# Altium project Elepaja.PrjPcb
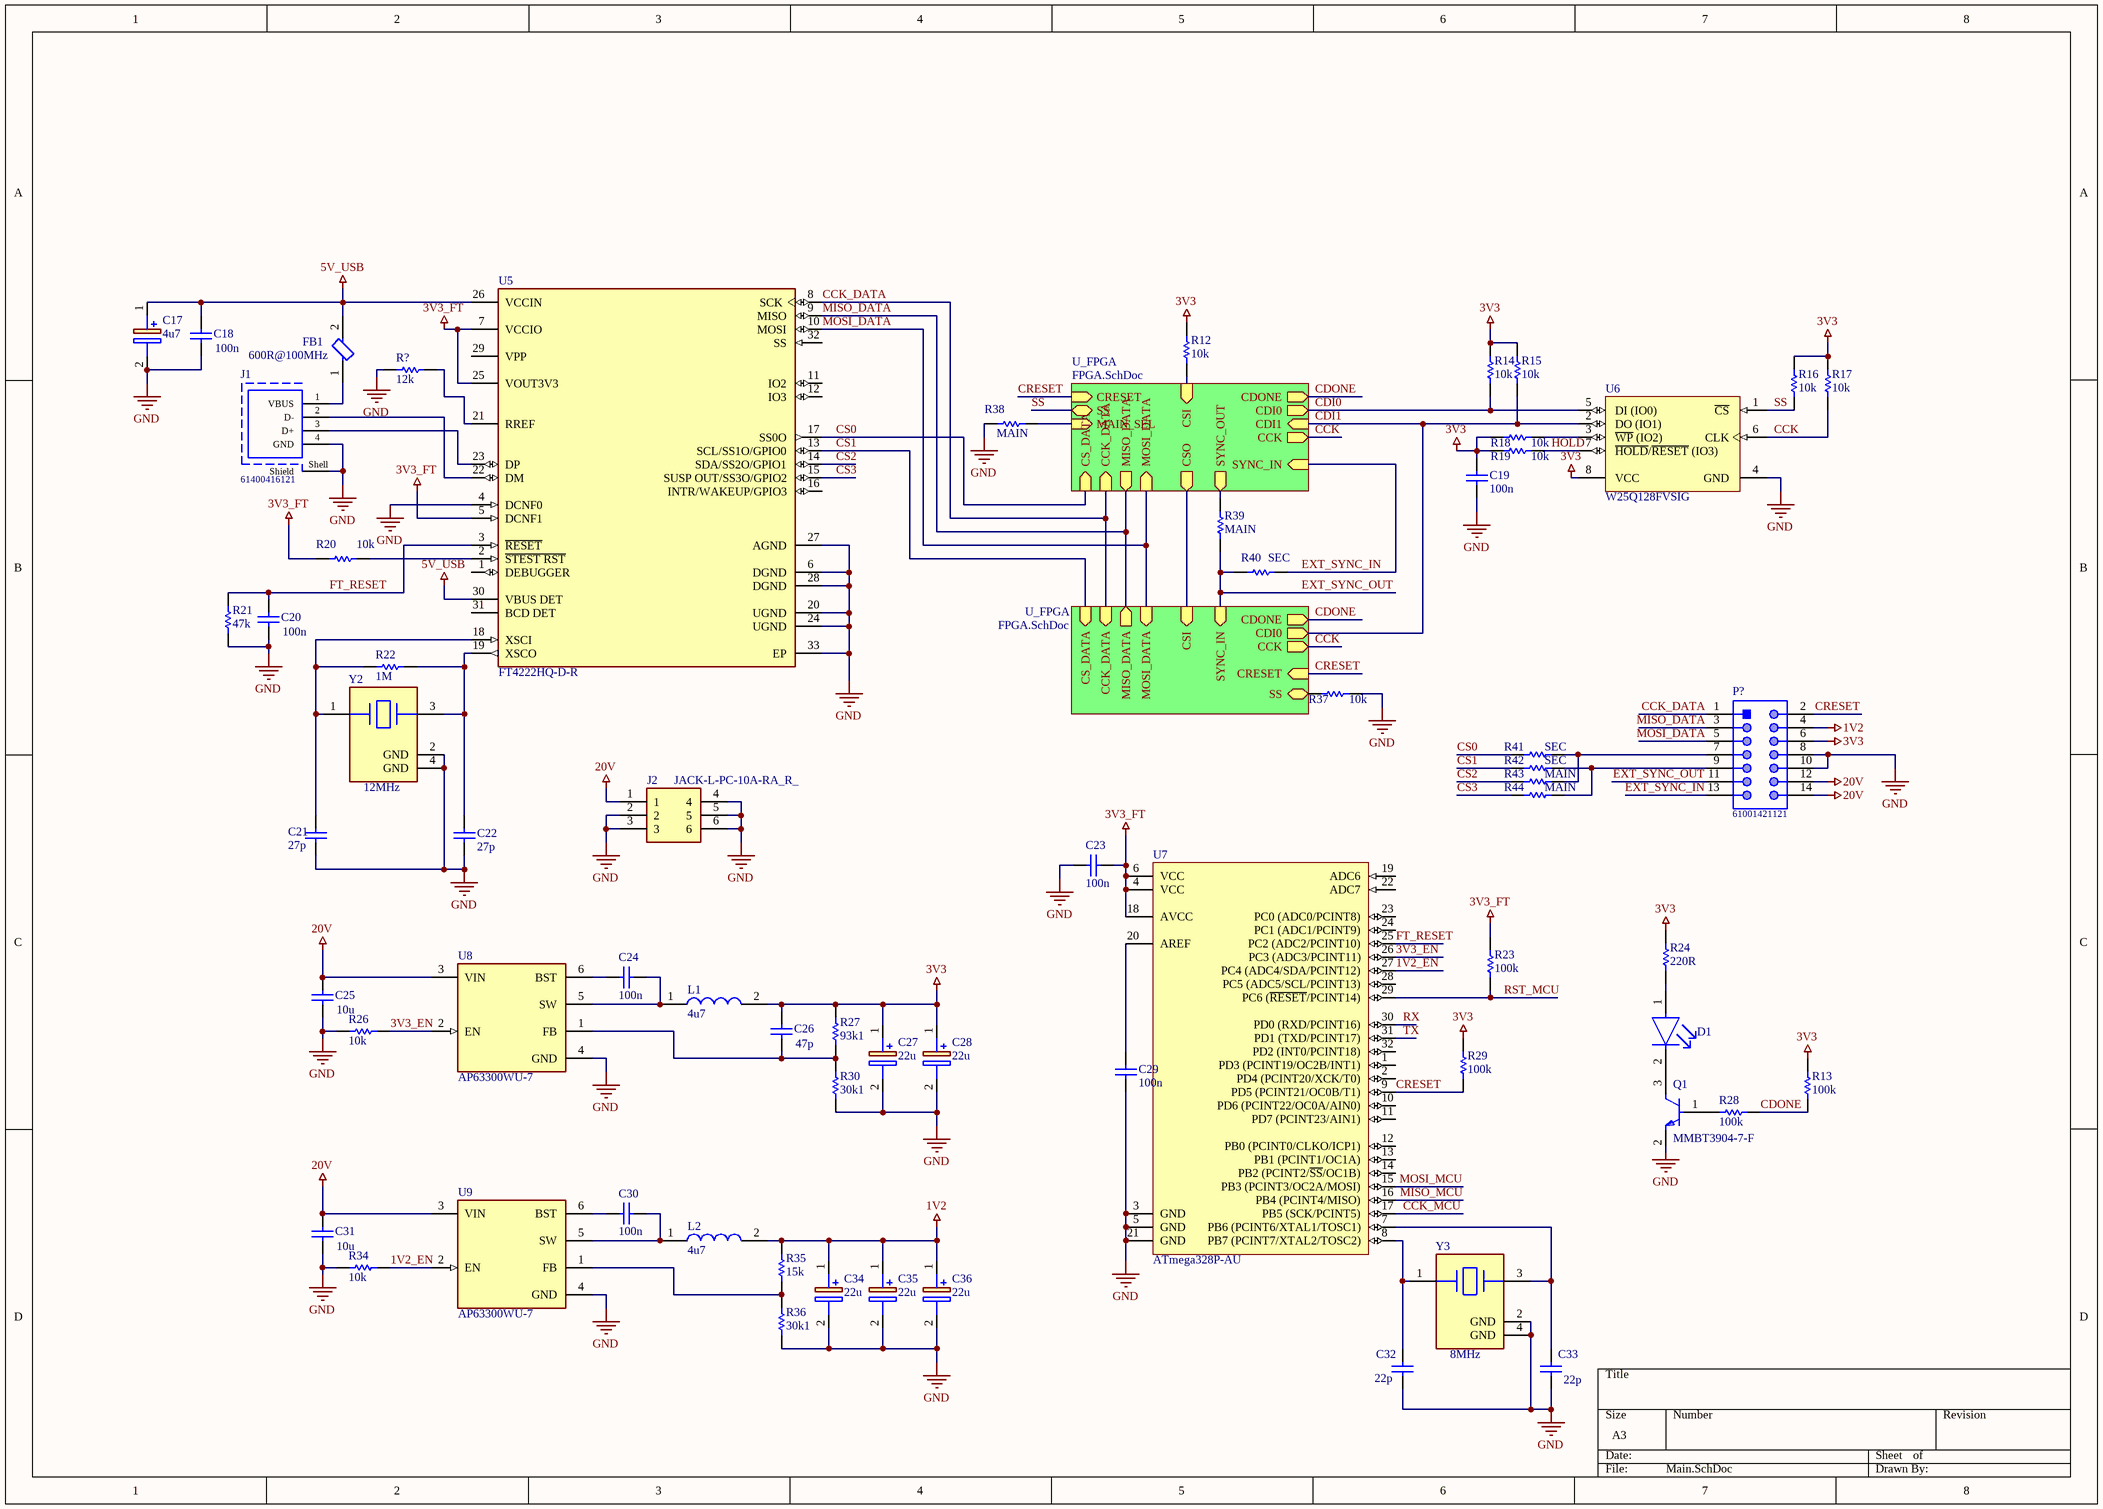
[diagram p0: Main.SchDoc]
4 sheets, 325 parts. Net scope: hierarchical (ports join the sheet entries above them; power ports are global).
Board file: Board.PcbDoc
Sheets:
  Main.SchDoc
    U_FPGA = FPGA.SchDoc
      U_Grid = Grid.SchDoc
        U_Transmitter = Transmitter.SchDoc
        U_Transmitter = Transmitter.SchDoc
        U_Transmitter = Transmitter.SchDoc
        U_Transmitter = Transmitter.SchDoc
        U_Transmitter = Transmitter.SchDoc
        U_Transmitter = Transmitter.SchDoc
        U_Transmitter = Transmitter.SchDoc
        U_Transmitter = Transmitter.SchDoc
        U_Transmitter = Transmitter.SchDoc
        U_Transmitter = Transmitter.SchDoc
        U_Transmitter = Transmitter.SchDoc
        U_Transmitter = Transmitter.SchDoc
        U_Transmitter = Transmitter.SchDoc
        U_Transmitter = Transmitter.SchDoc
        U_Transmitter = Transmitter.SchDoc
        U_Transmitter = Transmitter.SchDoc
        U_Transmitter = Transmitter.SchDoc
        U_Transmitter = Transmitter.SchDoc
        U_Transmitter = Transmitter.SchDoc
        U_Transmitter = Transmitter.SchDoc
        U_Transmitter = Transmitter.SchDoc
        U_Transmitter = Transmitter.SchDoc
        U_Transmitter = Transmitter.SchDoc
        U_Transmitter = Transmitter.SchDoc
        U_Transmitter = Transmitter.SchDoc
    U_FPGA = FPGA.SchDoc
      U_Grid = Grid.SchDoc
        U_Transmitter = Transmitter.SchDoc
        U_Transmitter = Transmitter.SchDoc
        U_Transmitter = Transmitter.SchDoc
        U_Transmitter = Transmitter.SchDoc
        U_Transmitter = Transmitter.SchDoc
        U_Transmitter = Transmitter.SchDoc
        U_Transmitter = Transmitter.SchDoc
        U_Transmitter = Transmitter.SchDoc
        U_Transmitter = Transmitter.SchDoc
        U_Transmitter = Transmitter.SchDoc
        U_Transmitter = Transmitter.SchDoc
        U_Transmitter = Transmitter.SchDoc
        U_Transmitter = Transmitter.SchDoc
        U_Transmitter = Transmitter.SchDoc
        U_Transmitter = Transmitter.SchDoc
        U_Transmitter = Transmitter.SchDoc
        U_Transmitter = Transmitter.SchDoc
        U_Transmitter = Transmitter.SchDoc
        U_Transmitter = Transmitter.SchDoc
        U_Transmitter = Transmitter.SchDoc
        U_Transmitter = Transmitter.SchDoc
        U_Transmitter = Transmitter.SchDoc
        U_Transmitter = Transmitter.SchDoc
        U_Transmitter = Transmitter.SchDoc
        U_Transmitter = Transmitter.SchDoc

## Sheet Main.SchDoc
size A3; SheetNumber: 1; SheetTotal: 4

### Parts
C17  4u7  [865080640004]
C18  100n  [SAMS-C0603-2_M]
C19  100n  [SAMS-C0603-2_M]
C20  100n  [SAMS-C0603-2_M]
C21  27p  [SAMS-C0603-2_M]
C22  27p  [SAMS-C0603-2_M]
C23  100n  [SAMS-C0603-2_M]
C24  100n  [SAMS-C0603-2_M]
C25  10u  [SAMS-C0603-2_M]
C26  47p  [SAMS-C0603-2_M]
C27  22u  [CAPAE430X550N]
C28  22u  [CAPAE430X550N]
C29  100n  [SAMS-C0603-2_M]
C30  100n  [SAMS-C0603-2_M]
C31  10u  [SAMS-C0603-2_M]
C32  22p  [SAMS-C0603-2_M]
C33  22p  [SAMS-C0603-2_M]
C34  22u  [CAPAE430X550N]
C35  22u  [CAPAE430X550N]
C36  22u  [CAPAE430X550N]
D1  (no value)  [FP-APT2012MGC-MFG]
FB1  600R@100MHz  [FP-MH1608-MFG]
J1  61400416121  [61400416121]
J2  JACK-L-PC-10A-RA_R_  [JACKLPC10ARAR]
L1  4u7  [SRP05204R7K]
L2  4u7  [SRP05204R7K]
P?  61001421121  [61001421121]
Q1  MMBT3904-7-F  [FP-SOT23-IPC_A]
R12  10k  [RESC1609X55X30LL15T15]
R13  100k  [RESC1609X55X30LL15T15]
R14  10k  [RESC1609X55X30LL15T15]
R15  10k  [RESC1609X55X30LL15T15]
R16  10k  [RESC1609X55X30LL15T15]
R17  10k  [RESC1609X55X30LL15T15]
R18  10k  [RESC1609X55X30LL15T15]
R19  10k  [RESC1609X55X30LL15T15]
R20  10k  [RESC1609X55X30LL15T15]
R21  47k  [RESC1609X55X30LL15T15]
R22  1M  [RESC1609X55X30LL15T15]
R23  100k  [RESC1609X55X30LL15T15]
R24  220R  [RESC1609X55X30LL15T15]
R26  10k  [RESC1609X55X30LL15T15]
R27  93k1  [RESC1609X55X30LL15T15]
R28  100k  [RESC1609X55X30LL15T15]
R29  100k  [RESC1609X55X30LL15T15]
R30  30k1  [RESC1609X55X30LL15T15]
R34  10k  [RESC1609X55X30LL15T15]
R35  15k  [RESC1609X55X30LL15T15]
R36  30k1  [RESC1609X55X30LL15T15]
R37  10k  [RESC1609X55X30LL15T15]
R38  MAIN  [RESC1005X40X20NL05T10]
R39  MAIN  [RESC1005X40X20NL05T10]
R40  SEC  [RESC1005X40X20NL05T10]
R41  SEC  [RESC1005X40X20NL05T10]
R42  SEC  [RESC1005X40X20NL05T10]
R43  MAIN  [RESC1005X40X20NL05T10]
R44  MAIN  [RESC1005X40X20NL05T10]
R?  12k  [RESC1609X55X30LL15T15]
U5  FT4222HQ-D-R  [FP-VQFN-32-MFG]
U6  W25Q128FVSIG  [WINB-SOIC-8_M]
U7  ATmega328P-AU  [32A_M]
U8  AP63300WU-7  [FP-TSOT26-IPC_A]
U9  AP63300WU-7  [FP-TSOT26-IPC_A]
Y2  12MHz  [FP-ABM3B-MFG]
Y3  8MHz  [FP-ABM3B-MFG]

### Sub-sheets
U_FPGA = FPGA.SchDoc: CDONE (out), CRESET (in), CDI1 (in), CDI0 (out), CCK (out), SS (bidir), MAIN_SEL (in), SYNC_OUT (out), SYNC_IN (in), CSI (in), CSO (out), CS_DATA (in), CCK_DATA (in), MISO_DATA (out), MOSI_DATA (in)
U_FPGA = FPGA.SchDoc: CDONE (out), CRESET (in), CDI0 (out), CCK (out), SS (bidir), SYNC_IN (in), CSI (in), MOSI_DATA (in), MISO_DATA (out), CCK_DATA (in), CS_DATA (in)

### Nets
1V2: C34.1(+) C35.1(+) C36.1(+) L2.2 P?.4 R35.2
3V3: C19.2 C26.1 C27.1(+) C28.1(+) L1.2 P?.6 R12.2 R13.1 R14.2 R15.2 R16.2 R17.2 R18.1 R19.1 R24.2 R27.2 R29.2 U6.8(VCC)
3V3_FT: C23.2 R20.1 R23.2 U5.5(DCNF1) U5.7(VCCIO) U5.25(VOUT3V3) U7.4(VCC) U7.6(VCC) U7.18(AVCC)
5V_USB: C17.1(+) C18.1 FB1.2 U5.26(VCCIN) U5.30(VBUS_DET)
20V: C25.1 C31.1 J2.1 P?.12 P?.14 U8.3(VIN) U9.3(VIN)
GND: C17.2(-) C18.2 C19.1 C20.2 C21.1 C22.1 C23.1 C25.2 C27.2(-) C28.2(-) C29.1 C31.2 C32.1 C33.1 C34.2(-) C35.2(-) C36.2(-) J1.4(GND) J1.Shell(Shield) J2.2 J2.3 J2.4 J2.5 J2.6 P?.8 P?.10 Q1.2(E) R21.1 R26.1 R30.1 R34.1 R36.1 R37.2 R38.2 R?.2 U5.4(DCNF0) U5.6(DGND) U5.20(UGND) U5.24(UGND) U5.27(AGND) U5.28(DGND) U5.33(EP) U6.4(GND) U7.3(GND) U7.5(GND) U7.21(GND) U8.4(GND) U9.4(GND) Y2.2(GND) Y2.4(GND) Y3.2(GND) Y3.4(GND)
1V2_EN: R34.2 U7.27(PC4_(ADC4/SDA/PCINT12)) U9.2(EN)
3V3_EN: R26.2 U7.26(PC3_(ADC3/PCINT11)) U8.2(EN)
CCK: R17.1 U6.6(CLK) ; sheet U_FPGA/CCK, sheet U_FPGA/CCK
CCK_DATA: P?.1 U5.8(SCK) ; sheet U_FPGA/CCK_DATA, sheet U_FPGA/CCK_DATA
CCK_MCU: U7.17(PB5_(SCK/PCINT5))
CDI0: R14.1 U6.5(DI_(IO0)) ; sheet U_FPGA/CDI0
CDI1: R15.1 U6.2(DO_(IO1)) ; sheet U_FPGA/CDI1, sheet U_FPGA/CDI0
CDONE: R13.2 R28.1 ; sheet U_FPGA/CDONE, sheet U_FPGA/CDONE
CRESET: P?.2 R29.1 U7.9(PD5_(PCINT21/OC0B/T1)) ; sheet U_FPGA/CRESET, sheet U_FPGA/CRESET
CS0: R41.2 U5.17(SS0O) ; sheet U_FPGA/CS_DATA
CS1: R42.2 U5.13(SCL/SS1O/GPIO0) ; sheet U_FPGA/CS_DATA
CS2: R43.2 U5.14(SDA/SS2O/GPIO1)
CS3: R44.2 U5.15(SUSP_OUT/SS3O/GPIO2)
EXT_SYNC_IN: P?.13 R40.1 ; sheet U_FPGA/SYNC_IN
EXT_SYNC_OUT: P?.11 R39.2 R40.2 ; sheet U_FPGA/SYNC_IN
FT_RESET: C20.1 R21.2 U5.3(~{RESET}) U7.25(PC2_(ADC2/PCINT10))
HOLD: R19.2 U6.7(~{HOLD}/~{RESET}_(IO3))
MISO_DATA: P?.3 U5.9(MISO) ; sheet U_FPGA/MISO_DATA, sheet U_FPGA/MISO_DATA
MISO_MCU: U7.16(PB4_(PCINT4/MISO))
MOSI_DATA: P?.5 U5.10(MOSI) ; sheet U_FPGA/MOSI_DATA, sheet U_FPGA/MOSI_DATA
MOSI_MCU: U7.15(PB3_(PCINT3/OC2A/MOSI))
RST_MCU: R23.1 U7.29(PC6_(~{RESET}/PCINT14))
RX: U7.30(PD0_(RXD/PCINT16))
SS: R16.1 U6.1(~{CS}) ; sheet U_FPGA/SS
TX: U7.31(PD1_(TXD/PCINT17))
NetC21_2: C21.2 R22.1 U5.18(XSCI) Y2.1
NetC22_2: C22.2 R22.2 U5.19(XSCO) Y2.3
NetC24_1: C24.1 U8.6(BST)
NetC24_2: C24.2 L1.1 U8.5(SW)
NetC26_2: C26.2 R27.1 R30.2 U8.1(FB)
NetC29_2: C29.2 U7.20(AREF)
NetC30_1: C30.1 U9.6(BST)
NetC30_2: C30.2 L2.1 U9.5(SW)
NetC32_2: C32.2 U7.8(PB7_(PCINT7/XTAL2/TOSC2)) Y3.1
NetC33_2: C33.2 U7.7(PB6_(PCINT6/XTAL1/TOSC1)) Y3.3
NetD1_1: D1.1(A) R24.1
NetD1_2: D1.2(C) Q1.3(C)
NetFB1_1: FB1.1 J1.1(VBUS)
NetJ1_2: J1.2(D-) U5.22(DM)
NetJ1_3: J1.3(D+) U5.23(DP)
NetP?_7: P?.7 R41.1 R43.1
NetP?_9: P?.9 R42.1 R44.1
NetQ1_1: Q1.1(B) R28.2
NetR1_U_FPGA#1_2: R38.1 ; sheet U_FPGA/MAIN_SEL
NetR12_1: R12.1 ; sheet U_FPGA/CSI
NetR18_2: R18.2 U6.3(~{WP}_(IO2))
NetR20_2: R20.2 U5.2(~{STEST_RST})
NetR35_1: R35.1 R36.2 U9.1(FB)
NetR37_1: R37.1 ; sheet U_FPGA/SS
NetR39_1: R39.1 ; sheet U_FPGA/SYNC_OUT
NetR?_1: R?.1 U5.21(RREF)
NetU1_U_FPGA#1_33: sheet U_FPGA/CSO, sheet U_FPGA/CSI

Not connected (* = marked no-connect by the designer): U5 1(DEBUGGER) 11(IO2) 12(IO3) 16(INTR/WAKEUP/GPIO3) 29(VPP) 31(BCD_DET) 32(SS); U7 1(PD3_(PCINT19/OC2B/INT1)) 2(PD4_(PCINT20/XCK/T0)) 10(PD6_(PCINT22/OC0A/AIN0)) 11(PD7_(PCINT23/AIN1)) 12(PB0_(PCINT0/CLKO/ICP1)) 13(PB1_(PCINT1/OC1A)) 14(PB2_(PCINT2/~{SS}/OC1B)) 19(ADC6) 22(ADC7) 23(PC0_(ADC0/PCINT8)) 24(PC1_(ADC1/PCINT9)) 28(PC5_(ADC5/SCL/PCINT13)) 32(PD2_(INT0/PCINT18))

### Library data of the parts
C17 = 865080640004: Capacitor Polarised; Manufacturer_Name: Wurth Elektronik; Datasheet Link: https://www.we-online.de/katalog/datasheet/865080640004.pdf; Height: 5.5mm; Manufacturer_Part_Number: 865080640004; Mouser Part Number: 710-865080640004; Mouser Price/Stock: https://www.mouser.co.uk/ProductDetail/Wurth-Elektronik/865080640004?qs=0KOYDY2FL2%2FjY4kqBxIvAg%3D%3D
C18-C26 C29-C33 = CMP-2000-05332-1: Multi-layer Ceramic Capacitor, -55 to 125 degC, 2-Pin SMD (0603), RoHS, Tape and Reel; Manufacturer: Samsung Electro-Mechanics; Capacitance: 0.1µF; Rated Voltage: 50V; Dielectric: X7R; Tolerance (%): ±10%; Case Size/Dimension: 0603; Datasheet URL: https://datasheet.ciiva.com/29198/456651-da-01-en-vs-kondensator-0605-29198839.pdf; Manufacturer URL: http://www.samsungsem.com/global/index.jsp; Datasheet Version: Nov-10
C27 C28 C34-C36 = 865080340003: Capacitor Polarised; Manufacturer_Name: Wurth Elektronik; Datasheet Link: http://uk.rs-online.com/web/p/products/1635695; Height: 5.5mm; Manufacturer_Part_Number: 865080340003; Mouser Part Number: 710-865080340003; Mouser Price/Stock: https://www.mouser.co.uk/ProductDetail/Wurth-Elektronik/865080340003?qs=0KOYDY2FL2%252BowmC4S50IuQ%3D%3D
D1 = CMP-44529-000017-1: LED GREEN CLEAR CHIP SMD; Power Rating: 75mW; Lens Color: Colorless; Luminous Intensity: 70mcd; Forward Current: 20mA; Dominant Wavelength: 570nm; Viewing Angle: 120°; Forward Voltage: 2.1V; Package Quantity: 2000; Color: Green; Length: 2mm; Lead Free: Lead Free; Min Operating Temperature: -40°C; Illumination Color: Green; Case/Package: 0805; Width: 1.25mm; Test Current: 20mA; Max Operating Temperature: 85°C; Case Code (Imperial): 0805; Mount: Surface Mount; Lens Style: Clear; Height: 0.75mm; Case Code (Metric): 2012; Packaging: Tape and Reel; Lens Transparency: Clear
FB1 = CMP-2000-06698-2: FERRITE BEAD 600 OHM 0603 1LN; Tolerance: 25%; Max DC Current: 1A; Test Frequency: 100MHz; Current Rating: 3A; Number of Lines: 1; DC Resistance (DCR): 25mR; Impedance: 600R; Case/Package: 0603; Packaging: Tape and Reel; Case Code (Imperial): 0603; Radiation Hardening: No; Package Quantity: 1; Height: 0.039inch; Width: 0.031inch; Series: MH; REACH SVHC: No SVHC; Depth: 1mm; Min Operating Temperature: -55°C; Length: 0.063inch; Case Code (Metric): 1608; Termination: SMD/SMT; RoHS Compliant: Yes; DC Current: 1A; Max Current Rating: 1A; Core Material: Ferrite; Mount: Surface Mount; Military Standard: Not; Max Operating Temperature: 125°C
J1 = CMP-1502-03243-1: USB 2.0 Type B Receptacle WR-COM, Horizontal, THT, with Pads and Pegs; Manufacturer: Wurth Elektronik; Contact Resistance: 20mOhm; Rated Current: 1.5A; Working Voltage: 30VAC; Package Reference: 61400416121; Part Number: 61400416121; Packaging: Tray; Mounting Technology: THT; Gender: Receptacle; Datasheet URL: https://katalog.we-online.de/em/datasheet/61400416121.pdf; Publisher: WurthElektronik; Orientation: Horizontal; Connector Type: USB2.0TypeB; Operating Temperature: -40to105degC; Manufacturer URL: http://www.we-online.de
J2 = JACK-L-PC-10A-RA_R_: Connector; Manufacturer_Name: GlobTek; Manufacturer_Part_Number: JACK-L-PC-10A-RA(R); Datasheet Link: https://www.globtek.com/pdf/manual-datasheets/JACK-L-PC-10A-RA%28R%29.pdf; Height: 10mm
L1 L2 = SRP0520-4R7K: Inductor; Manufacturer_Name: Bourns; Datasheet Link: http://www.bourns.com/docs/Product-Datasheets/SRP0520.pdf; Height: 2mm; Manufacturer_Part_Number: SRP0520-4R7K; Mouser Part Number: 652-SRP0520-4R7K; Mouser Price/Stock: https://www.mouser.co.uk/ProductDetail/Bourns/SRP0520-4R7K?qs=OlC7AqGiEDkW8f66KV8wEw%3D%3D; Arrow Part Number: SRP0520-4R7K; Arrow Price/Stock: https://www.arrow.com/en/products/srp0520-4r7k/bourns?region=nac
P? = CMP-1502-01031-1: SMT Vertical Pin Header WR-PHD, Pitch 2.54 mm, Dual Row, 14 pins; Manufacturer: Wurth Elektronik; Withstanding Voltage: 500VAC; Working Voltage: 250VAC; Contact Resistance: 20mOhm; Pitch: 2.54mm; Rated Current: 3A; Gender: Male; Pin Number: 14; Datasheet URL: https://katalog.we-online.de/em/datasheet/6100xx21121.pdf; Operating Temperature: -40to125degC; Manufacturer URL: http://www.we-online.de; Mounting Technology: SMT; Publisher: WurthElektronik; Packaging: Tube; Orientation: Vertical; Row Number: Dual; Part Number: 61001421121; Package Reference: 61001421121
Q1 = CMP-2000-04931-2: TRANS NPN 40V 0.2A SMD SOT23-3; Frequency: 300MHz; Power Dissipation: 350mW; Element Configuration: Single; Max Power Dissipation: 300mW; Max Collector Current: 200mA; Collector Emitter Saturation Voltage: 300mV; Number of Elements: 1; hFE Min: 100; Collector Base Voltage (VCBO): 60V; Emitter Base Voltage (VEBO): 6V; Contact Plating: Tin; Package Quantity: 3000; Max Frequency: 300MHz; REACH SVHC: No SVHC; Max Operating Temperature: 150°C; Width: 1.4mm; Collector Emitter Voltage (VCEO): 40V; Voltage Rating (DC): 40V; Radiation Hardening: No; Case/Package: SOT-23; Height: 1mm; Collector Emitter Breakdown Voltage: 40V; Length: 3.05mm; Polarity: NPN; Packaging: Tape and Reel; Number of Pins: 3; Min Operating Temperature: -55°C; Gain Bandwidth Product: 300MHz; Mount: Surface Mount; Weight: 0.000282oz; Continuous Collector Current: 200mA; Transition Frequency: 300MHz; Max Breakdown Voltage: 40V; Lead Free: Lead Free
R12-R24 R26-R30 R34-R37 R? = CMP-1012-00623-3: Chip Resistor, 10 KOhm, +/- 1%, 0.1 W, -55 to 155 degC, 0603 (1608 Metric), RoHS, Tape and Reel; Manufacturer: Panasonic; Voltage Rating: 75V; Case\/Package: 0603; Power Rating: 100mW; Resistance: 10KOhm; Temperature Coefficient: 100ppm\/degreesC; Number of Pins: 2; Package Reference: 603; Depth: 0.8mm; Mount: SurfaceMount; Package Description: 2-Pin Surface Mount Device, Body 1.6 x 0.85 mm; Datasheet Version: 02/2017; Length: 1.6mm; Lead Free: LeadFree; Height: 0.45mm; Number of Terminations: 2; Max Power Dissipation: 100mW; Min Operating Temperature: -55degC; Datasheet URL: https://industrial.panasonic.com/cdbs/www-data/pdf/RDA0000/AOA0000C304.pdf; Termination: SMD/SMT; Case Code (Metric): 1608; Case Code (Imperial): 0603; Tolerance: 1%; Max Operating Temperature: 155degC; RoHSCompliant: true; Voltage Rating (DC): 75V; Radiation Hardening: No; Packaging: TapeandReel; Composition: ThickFilm; Mounting Technology: SurfaceMount; Manufacturer URL: http://www.panasonic.com/; Width: 0.031inch; REACH SVHC: NoSVHC; Contact Plating: Tin; Military Standard: Not; Package Quantity: 1
R38-R44 = CMP-2002-01682-1: Manufacturer: Vishay BCcomponents; Part Number: TNPW040210K0DEED
U5 = CMP-194822-000008-1: IC BRIDGE USB TO I2C/SPI 32VQFN; Interface: I2C; Operating Supply Current: 78mA; Case/Package: VQFN; Max Operating Temperature: 85°C; Min Operating Temperature: -40°C; Packaging: Tape and Reel
U6 = CMP-2000-05005-1: 3V 128M-Bit Serial Flash Memory with Dual/Quad SPI & QPI, 2.7 to 3.6 V, -40 to 85 degC, 8-Pin SOIC, RoHS, Tape and Reel; Manufacturer: Winbond; Number of Words: 16777216; Address Bus: 24b; Word Size: 8b; Boot Type: NotRequired; Supply Current: 20mA; Operating Supply Voltage (Max): 3.6V; Sync/Async: Synchronous; Rad Hardened: No; Interface Type: Serial(SPI); Access Time (Max): 7ns; Operating Supply Voltage (Min): 2.7V; Operating Supply Voltage (Typ): 3/3.3V; Programmable: Yes; Density: 134217728Bit; Cell Type: NOR; Package Description: 8-Pin Small Outline Integrated Circuit, Body 5.28 x 5.28 mm, Pitch 1.27 mm; Datasheet URL: http://download.siliconexpert.com/pdfs/2015/11/30/6/42/17/890/win_/manual/3w25q128fv20rev.l2008242015.pdf; Package Reference: SS-8; Package Type: SOICW; Datasheet Version: Rev. L, 08/2015; Manufacturer URL: http://www.winbond.com/hq/index.html?__locale=en; Pin Count: 8; Operating Temperature Classification: Industrial; Operating Temperature (Min): -40C; Program/Erase Volt (Typ): 2.7to3.6V; Operating Temperature (Max): 85C; Mounting: SurfaceMount; Operating Temp Range: -40Cto85C
U7 = CMP-0095-00269-2: 8-bit AVR Microcontroller, 32KB Flash, 1KB EEPROM, 2KB SRAM, 32-pin TQFP, Industrial Grade (-40°C to 85°C); PackageDescription: 32-Lead, 7x7x1.0 mm Body, 0.8mm Lead Pitch, Thin Profile Plastic Quad Flat Package (TQFP); DatasheetVersion: revD, May-2011; RevisionNote: DatasheetVersion & PackageVersion updated. URLs added.; ComponentLink1URL: http://www.atmel.com/; ComponentLink2Description: ATmega48A/48PA/88A/88PA/168A/168PA/328/328P Datasheet; Code_JEDEC: MS-026-ABA; ComponentLink1Description: Manufacturer URL; PackageReference: 32A; ComponentLink3Description: ATmega48A/48PA/88A/88PA/168A/168PA/328/328P Summary; ComponentLink2URL: http://www.atmel.com/dyn/resources/prod_documents/doc8271.pdf; PackageVersion: revC, Oct-2010; ComponentLink3URL: http://www.atmel.com/dyn/resources/prod_documents/8271S.pdf
U8 U9 = CMP-12757-000025-1: DCDC CONV HV BUCK TSOT26
Y2 = CMP-1688-00007-2: Crystal 12MHz ±20ppm 18pF SMD-4 5mm x 3.2mm; Series Resistance: 70R; Frequency Stability: 50ppm; REACH SVHC: No SVHC; Package Quantity: 1000; Min Operating Temperature: -20°C; Mount: Surface Mount; Frequency: 12MHz; Length: 5mm; Termination: SMD/SMT; Load Capacitance: 18pF; Lead Free: Lead Free; Case/Package: CSMD; Number of Pins: 4; Max Operating Temperature: 70°C; Height: 0.043inch; Radiation Hardening: No; Series: ABM3B; Operating Frequency: 12 MHz; Depth: 3.2mm; Tolerance: 20ppm; ESR (Equivalent Series Resistance): 70R; Width: 0.126inch; Resistor Type: Ceramic; Frequency Tolerance: 20ppm; Packaging: Tape and Reel
Y3 = CMP-1688-00002-2: Crystal 8MHz ±20ppm 18pF SMD-4 5mm x 3.2mm; ESR (Equivalent Series Resistance): 200R; Frequency Stability: 50ppm; Operating Frequency: 8 MHz; Mount: Surface Mount; Number of Pins: 4; Packaging: Tape and Reel; Width: 0.126inch; Case/Package: CSMD; Lead Free: Lead Free; Depth: 3.2mm; Load Capacitance: 18pF; Min Operating Temperature: -20°C; Series: ABM3B; Package Quantity: 1000; Resistor Type: Ceramic; Height: 0.043inch; Max Operating Temperature: 70°C; Frequency Tolerance: 20ppm; Series Resistance: 200R; Tolerance: 20ppm; Termination: SMD/SMT; Length: 5mm; Frequency: 8MHz

## Sheet FPGA.SchDoc
size A3; SheetNumber: 2; SheetTotal: 4
Used 2 times, as channels U_FPGA, U_FPGA. Parts and nets are listed once, with the designators drawn on the sheet.
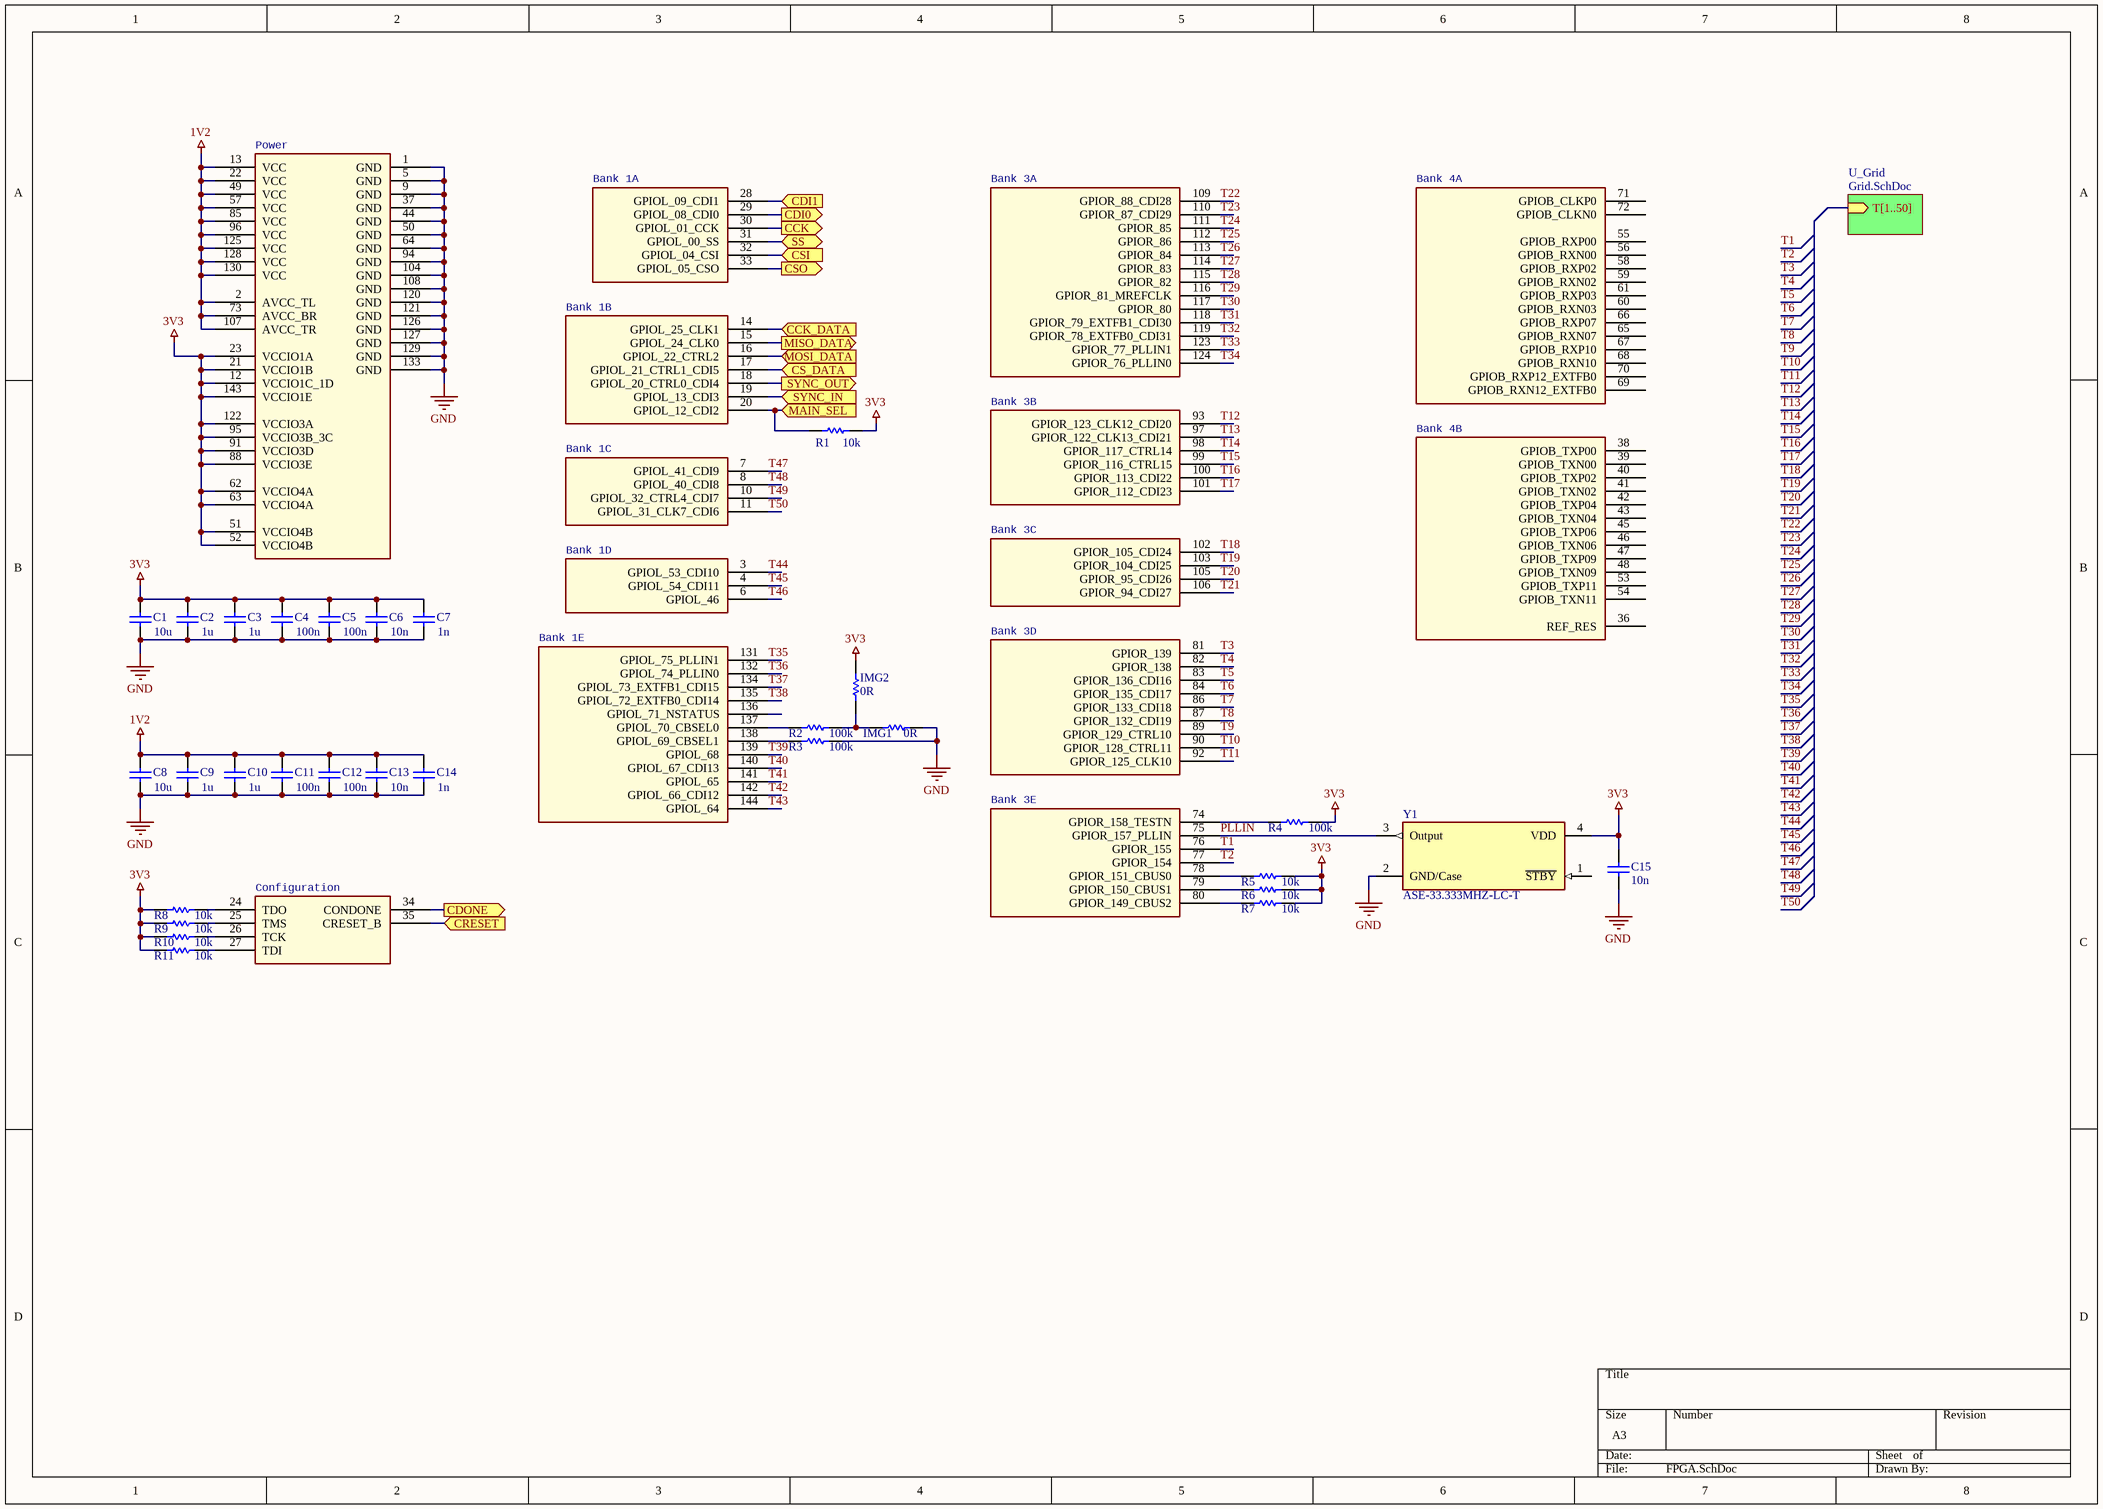
[diagram p1: FPGA.SchDoc]

### Parts
C1  10u  [SAMS-C0603-2_M]
C2  1u  [SAMS-C0603-2_M]
C3  1u  [SAMS-C0603-2_M]
C4  100n  [SAMS-C0603-2_M]
C5  100n  [SAMS-C0603-2_M]
C6  10n  [SAMS-C0603-2_M]
C7  1n  [SAMS-C0603-2_M]
C8  10u  [SAMS-C0603-2_M]
C9  1u  [SAMS-C0603-2_M]
C10  1u  [SAMS-C0603-2_M]
C11  100n  [SAMS-C0603-2_M]
C12  100n  [SAMS-C0603-2_M]
C13  10n  [SAMS-C0603-2_M]
C14  1n  [SAMS-C0603-2_M]
C15  10n  [SAMS-C0603-2_M]
IMG1  0R  [RESC1005X40X20NL05T10]
IMG2  0R  [RESC1005X40X20NL05T10]
R1  10k  [RESC1609X55X30LL15T15]
R2  100k  [RESC1609X55X30LL15T15]
R3  100k  [RESC1609X55X30LL15T15]
R4  100k  [RESC1609X55X30LL15T15]
R5  10k  [RESC1609X55X30LL15T15]
R6  10k  [RESC1609X55X30LL15T15]
R7  10k  [RESC1609X55X30LL15T15]
R8  10k  [RESC1609X55X30LL15T15]
R9  10k  [RESC1609X55X30LL15T15]
R10  10k  [RESC1609X55X30LL15T15]
R11  10k  [RESC1609X55X30LL15T15]
U1  T8Q144Cx  [LQFP144]  (value not drawn)  (parts A,B,C,D,E,F,G,H,I,J,K,L,M,N of 14)
Y1  ASE-33.333MHZ-LC-T  [FP-ASE-MFG]

### Sub-sheets
U_Grid = Grid.SchDoc: T[1..50] (in)

### Ports
CCK (out), CCK_DATA (in), CDI0 (out), CDI1 (in), CDONE (out), CRESET (in), CS_DATA (in), CSI (in), CSO (out), MAIN_SEL (in), MISO_DATA (out), MOSI_DATA (in), SS (bidir), SYNC_IN (in), SYNC_OUT (out)

### Nets
1V2: C8.1 C9.1 C10.1 C11.1 C12.1 C13.1 C14.1 U1.2(AVCC_TL) U1.13(VCC) U1.22(VCC) U1.49(VCC) U1.57(VCC) U1.73(AVCC_BR) U1.85(VCC) U1.96(VCC) U1.107(AVCC_TR) U1.125(VCC) U1.128(VCC) U1.130(VCC)
3V3: C1.1 C2.1 C3.1 C4.1 C5.1 C6.1 C7.1 C15.2 IMG2.2 R1.1 R4.2 R5.2 R6.2 R7.2 R8.1 R9.1 R10.1 R11.1 U1.12(VCCIO1C_1D) U1.21(VCCIO1B) U1.23(VCCIO1A) U1.51(VCCIO4B) U1.52(VCCIO4B) U1.62(VCCIO4A) U1.63(VCCIO4A) U1.88(VCCIO3E) U1.91(VCCIO3D) U1.95(VCCIO3B_3C) U1.122(VCCIO3A) U1.143(VCCIO1E) Y1.4(VDD)
GND: C1.2 C2.2 C3.2 C4.2 C5.2 C6.2 C7.2 C8.2 C9.2 C10.2 C11.2 C12.2 C13.2 C14.2 C15.1 IMG1.2 R3.2 U1.1(GND) U1.5(GND) U1.9(GND) U1.37(GND) U1.44(GND) U1.50(GND) U1.64(GND) U1.94(GND) U1.104(GND) U1.108(GND) U1.120(GND) U1.121(GND) U1.126(GND) U1.127(GND) U1.129(GND) U1.133(GND) Y1.2(GND/Case)
CCK: U1.30(GPIOL_01_CCK) ; port CCK
CCK_DATA: U1.14(GPIOL_25_CLK1) ; port CCK_DATA
CDI0: U1.29(GPIOL_08_CDI0) ; port CDI0
CDI1: U1.28(GPIOL_09_CDI1) ; port CDI1
CDONE: U1.34(CONDONE) ; port CDONE
CRESET: U1.35(CRESET_B) ; port CRESET
CS_DATA: U1.17(GPIOL_21_CTRL1_CDI5) ; port CS_DATA
CSI: U1.32(GPIOL_04_CSI) ; port CSI
CSO: U1.33(GPIOL_05_CSO) ; port CSO
MAIN_SEL: R1.2 U1.20(GPIOL_12_CDI2) ; port MAIN_SEL
MISO_DATA: U1.15(GPIOL_24_CLK0) ; port MISO_DATA
MOSI_DATA: U1.16(GPIOL_22_CTRL2) ; port MOSI_DATA
PLLIN: U1.75(GPIOR_157_PLLIN) Y1.3(Output)
SS: U1.31(GPIOL_00_SS) ; port SS
SYNC_IN: U1.19(GPIOL_13_CDI3) ; port SYNC_IN
SYNC_OUT: U1.18(GPIOL_20_CTRL0_CDI4) ; port SYNC_OUT
T1: U1.76(GPIOR_155)
T2: U1.77(GPIOR_154)
T3: U1.81(GPIOR_139)
T4: U1.82(GPIOR_138)
T5: U1.83(GPIOR_136_CDI16)
T6: U1.84(GPIOR_135_CDI17)
T7: U1.86(GPIOR_133_CDI18)
T8: U1.87(GPIOR_132_CDI19)
T9: U1.89(GPIOR_129_CTRL10)
T10: U1.90(GPIOR_128_CTRL11)
T11: U1.92(GPIOR_125_CLK10)
T12: U1.93(GPIOR_123_CLK12_CDI20)
T13: U1.97(GPIOR_122_CLK13_CDI21)
T14: U1.98(GPIOR_117_CTRL14)
T15: U1.99(GPIOR_116_CTRL15)
T16: U1.100(GPIOR_113_CDI22)
T17: U1.101(GPIOR_112_CDI23)
T18: U1.102(GPIOR_105_CDI24)
T19: U1.103(GPIOR_104_CDI25)
T20: U1.105(GPIOR_95_CDI26)
T21: U1.106(GPIOR_94_CDI27)
T22: U1.109(GPIOR_88_CDI28)
T23: U1.110(GPIOR_87_CDI29)
T24: U1.111(GPIOR_85)
T25: U1.112(GPIOR_86)
T26: U1.113(GPIOR_84)
T27: U1.114(GPIOR_83)
T28: U1.115(GPIOR_82)
T29: U1.116(GPIOR_81_MREFCLK)
T30: U1.117(GPIOR_80)
T31: U1.118(GPIOR_79_EXTFB1_CDI30)
T32: U1.119(GPIOR_78_EXTFB0_CDI31)
T33: U1.123(GPIOR_77_PLLIN1)
T34: U1.124(GPIOR_76_PLLIN0)
T35: U1.131(GPIOL_75_PLLIN1)
T36: U1.132(GPIOL_74_PLLIN0)
T37: U1.134(GPIOL_73_EXTFB1_CDI15)
T38: U1.135(GPIOL_72_EXTFB0_CDI14)
T39: U1.139(GPIOL_68)
T40: U1.140(GPIOL_67_CDI13)
T41: U1.141(GPIOL_65)
T42: U1.142(GPIOL_66_CDI12)
T43: U1.144(GPIOL_64)
T44: U1.3(GPIOL_53_CDI10)
T45: U1.4(GPIOL_54_CDI11)
T46: U1.6(GPIOL_46)
T47: U1.7(GPIOL_41_CDI9)
T48: U1.8(GPIOL_40_CDI8)
T49: U1.10(GPIOL_32_CTRL4_CDI7)
T50: U1.11(GPIOL_31_CLK7_CDI6)
NetIMG1_1: IMG1.1 IMG2.1 R2.2
NetR2_1: R2.1 U1.137(GPIOL_70_CBSEL0)
NetR3_1: R3.1 U1.138(GPIOL_69_CBSEL1)
NetR4_1: R4.1 U1.74(GPIOR_158_TESTN)
NetR5_1: R5.1 U1.78(GPIOR_151_CBUS0)
NetR6_1: R6.1 U1.79(GPIOR_150_CBUS1)
NetR7_1: R7.1 U1.80(GPIOR_149_CBUS2)
NetR8_2: R8.2 U1.24(TDO)
NetR9_2: R9.2 U1.25(TMS)
NetR10_2: R10.2 U1.26(TCK)
NetR11_2: R11.2 U1.27(TDI)

Not connected (* = marked no-connect by the designer): U1 36(REF_RES) 38(GPIOB_TXP00) 39(GPIOB_TXN00) 40(GPIOB_TXP02) 41(GPIOB_TXN02) 42(GPIOB_TXP04) 43(GPIOB_TXN04) 45(GPIOB_TXP06) 46(GPIOB_TXN06) 47(GPIOB_TXP09) 48(GPIOB_TXN09) 53(GPIOB_TXP11) 54(GPIOB_TXN11) 55(GPIOB_RXP00) 56(GPIOB_RXN00) 58(GPIOB_RXP02) 59(GPIOB_RXN02) 60(GPIOB_RXN03) 61(GPIOB_RXP03) 65(GPIOB_RXN07) 66(GPIOB_RXP07) 67(GPIOB_RXP10) 68(GPIOB_RXN10) 69(GPIOB_RXN12_EXTFB0) 70(GPIOB_RXP12_EXTFB0) 71(GPIOB_CLKP0) 72(GPIOB_CLKN0) 136(GPIOL_71_NSTATUS); Y1 1(~{STBY})

### Channels
U_FPGA: designators end in _U_FPGA#1; ports CCK=CCK CCK_DATA=CCK_DATA CDI0=CDI0 CDI1=CDI1 CDONE=CDONE CRESET=CRESET CS_DATA=CS0 CSI=NetR12_1 CSO=NetU1_U_FPGA#1_33 MAIN_SEL=NetR1_U_FPGA#1_2 MISO_DATA=MISO_DATA MOSI_DATA=MOSI_DATA SS=SS SYNC_IN=EXT_SYNC_IN SYNC_OUT=NetR39_1
U_FPGA: designators end in _U_FPGA#2; ports CCK=CCK CCK_DATA=CCK_DATA CDI0=CDI1 CDI1=NetU1_U_FPGA#2_28 CDONE=CDONE CRESET=CRESET CS_DATA=CS1 CSI=NetU1_U_FPGA#1_33 CSO=NetU1_U_FPGA#2_33 MAIN_SEL=NetR1_U_FPGA#2_2 MISO_DATA=MISO_DATA MOSI_DATA=MOSI_DATA SS=NetR37_1 SYNC_IN=EXT_SYNC_OUT SYNC_OUT=NetU1_U_FPGA#2_18

### Notes on the sheet
- (in symbol T8Q144Cx, part A) Power
- (in symbol T8Q144Cx, part B) Configuration
- (in symbol T8Q144Cx, part C) Bank 1A
- (in symbol T8Q144Cx, part D) Bank 1B
- (in symbol T8Q144Cx, part E) Bank 1C
- (in symbol T8Q144Cx, part F) Bank 1D
- (in symbol T8Q144Cx, part G) Bank 1E
- (in symbol T8Q144Cx, part H) Bank 3A
- (in symbol T8Q144Cx, part I) Bank 3B
- (in symbol T8Q144Cx, part J) Bank 3C
- (in symbol T8Q144Cx, part K) Bank 3D
- (in symbol T8Q144Cx, part L) Bank 3E
- (in symbol T8Q144Cx, part M) Bank 4A
- (in symbol T8Q144Cx, part N) Bank 4B

### Library data of the parts
C1-C15 = CMP-2000-05332-1: as C18 on sheet Main; Case Size/Dimension: 0603; Datasheet URL: https://datasheet.ciiva.com/29198/456651-da-01-en-vs-kondensator-0605-29198839.pdf; Manufacturer URL: http://www.samsungsem.com/global/index.jsp; Datasheet Version: Nov-10
IMG1 IMG2 = CMP-2002-01682-1: as R38 on sheet Main
R1-R11 = CMP-1012-00623-3: as R12 on sheet Main; Number of Pins: 2; Package Reference: 603; Depth: 0.8mm; Mount: SurfaceMount; Package Description: 2-Pin Surface Mount Device, Body 1.6 x 0.85 mm; Datasheet Version: 02/2017; Length: 1.6mm; Lead Free: LeadFree; Height: 0.45mm; Number of Terminations: 2; Max Power Dissipation: 100mW; Min Operating Temperature: -55degC; Datasheet URL: https://industrial.panasonic.com/cdbs/www-data/pdf/RDA0000/AOA0000C304.pdf; Termination: SMD/SMT; Case Code (Metric): 1608; Case Code (Imperial): 0603; Tolerance: 1%; Max Operating Temperature: 155degC; RoHSCompliant: true; Voltage Rating (DC): 75V; Radiation Hardening: No; Packaging: TapeandReel; Composition: ThickFilm; Mounting Technology: SurfaceMount; Manufacturer URL: http://www.panasonic.com/; Width: 0.031inch; REACH SVHC: NoSVHC; Contact Plating: Tin; Military Standard: Not; Package Quantity: 1
U1 = T8Q144Cx: SPLIT_INST: TRUE; SWAP_INFO: (S1+S2+S3+S4+S5+S6+S7+S8+S9+S10+S11+S12+S13+S14)
Y1 = CMP-27762-010648-1: XTAL Oscillator 33.333MHz ±50ppm CMOS 3.3V 4-SMD 3.2mm x 2.5mm; Max Supply Voltage: 3.465V; Load Capacitance: 15pF; Min Supply Voltage: 3.135V; Max Supply Current: 13mA; Package Quantity: 1000; Frequency: 33.333MHz; Radiation Hardening: No; Case/Package: SMD/SMT; REACH SVHC: No SVHC; Max Operating Temperature: 85°C; Operating Supply Voltage: 3.3V; Depth: 2.5mm; Height: 0.047inch; Mount: Surface Mount; Lead Free: Lead Free; Width: 0.098inch; Packaging: Tape and Reel; Operating Frequency: 33.333 MHz; Series: ASE; Termination: SMD/SMT; Min Operating Temperature: -40°C; Frequency Stability: 50ppm; Number of Pins: 4; Length: 3.2mm

## Sheet Grid.SchDoc
size 203 x 228 mm; SheetNumber: 3; SheetTotal: 4
Used 2 times, as channels U_FPGA/U_Grid, U_FPGA/U_Grid. Parts and nets are listed once, with the designators drawn on the sheet.
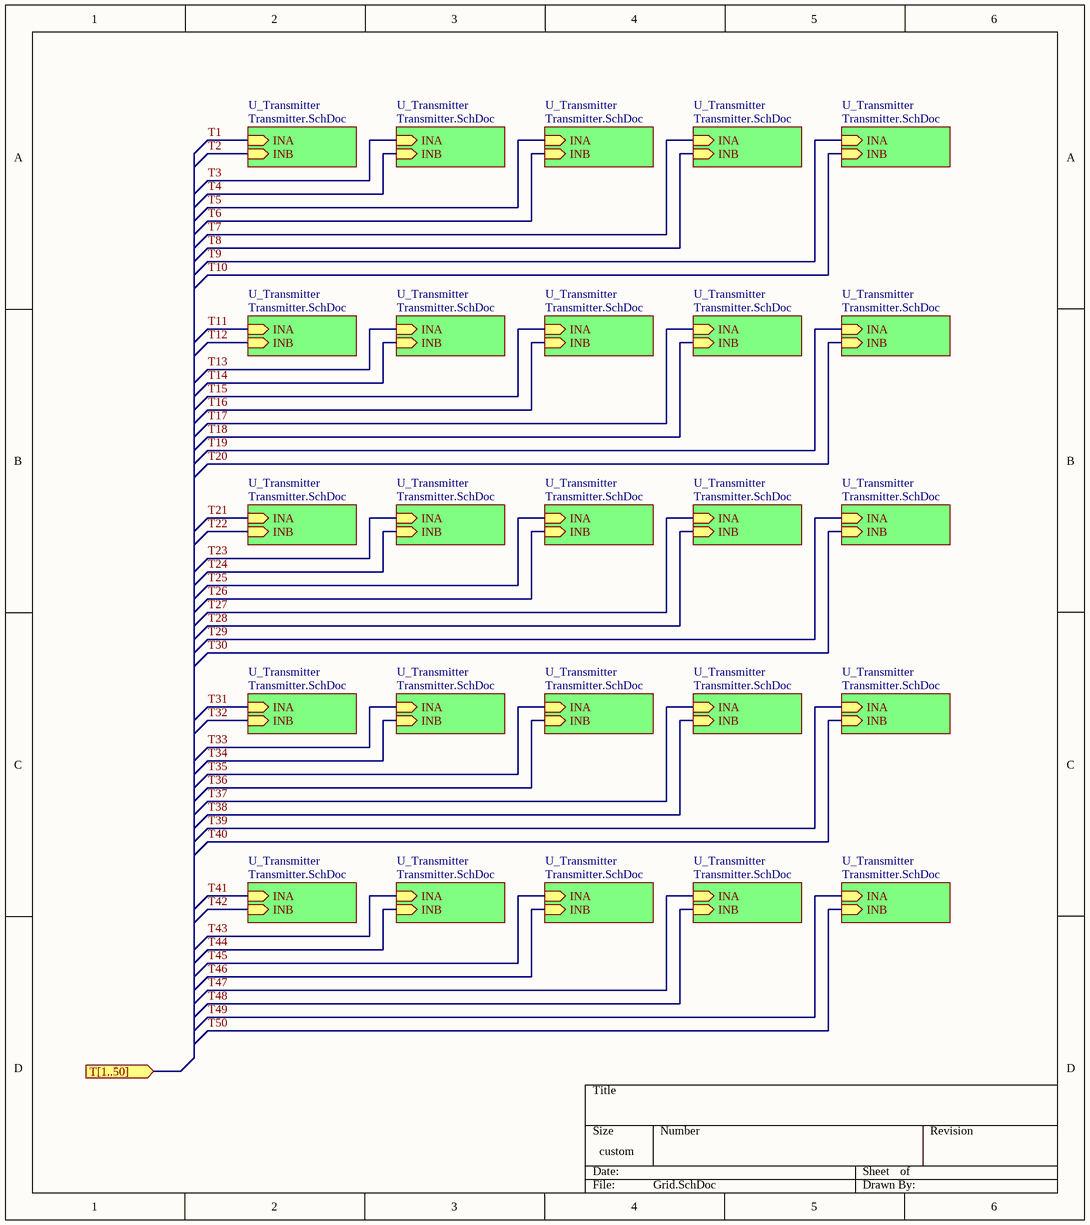
[diagram p2: Grid.SchDoc]

### Sub-sheets
U_Transmitter = Transmitter.SchDoc: INA (in), INB (in)
U_Transmitter = Transmitter.SchDoc: INA (in), INB (in)
U_Transmitter = Transmitter.SchDoc: INA (in), INB (in)
U_Transmitter = Transmitter.SchDoc: INA (in), INB (in)
U_Transmitter = Transmitter.SchDoc: INA (in), INB (in)
U_Transmitter = Transmitter.SchDoc: INA (in), INB (in)
U_Transmitter = Transmitter.SchDoc: INA (in), INB (in)
U_Transmitter = Transmitter.SchDoc: INA (in), INB (in)
U_Transmitter = Transmitter.SchDoc: INA (in), INB (in)
U_Transmitter = Transmitter.SchDoc: INA (in), INB (in)
U_Transmitter = Transmitter.SchDoc: INA (in), INB (in)
U_Transmitter = Transmitter.SchDoc: INA (in), INB (in)
U_Transmitter = Transmitter.SchDoc: INA (in), INB (in)
U_Transmitter = Transmitter.SchDoc: INA (in), INB (in)
U_Transmitter = Transmitter.SchDoc: INA (in), INB (in)
U_Transmitter = Transmitter.SchDoc: INA (in), INB (in)
U_Transmitter = Transmitter.SchDoc: INA (in), INB (in)
U_Transmitter = Transmitter.SchDoc: INA (in), INB (in)
U_Transmitter = Transmitter.SchDoc: INA (in), INB (in)
U_Transmitter = Transmitter.SchDoc: INA (in), INB (in)
U_Transmitter = Transmitter.SchDoc: INA (in), INB (in)
U_Transmitter = Transmitter.SchDoc: INA (in), INB (in)
U_Transmitter = Transmitter.SchDoc: INA (in), INB (in)
U_Transmitter = Transmitter.SchDoc: INA (in), INB (in)
U_Transmitter = Transmitter.SchDoc: INA (in), INB (in)

### Ports
T[1..50] (in)

### Channels
U_FPGA/U_Grid: no parts or ports
U_FPGA/U_Grid: no parts or ports

## Sheet Transmitter.SchDoc
size 127 x 101 mm; SheetNumber: 4; SheetTotal: 4
Used 50 times, as channels U_FPGA/U_Grid/U_Transmitter, U_FPGA/U_Grid/U_Transmitter, U_FPGA/U_Grid/U_Transmitter, U_FPGA/U_Grid/U_Transmitter, U_FPGA/U_Grid/U_Transmitter, U_FPGA/U_Grid/U_Transmitter, U_FPGA/U_Grid/U_Transmitter, U_FPGA/U_Grid/U_Transmitter, U_FPGA/U_Grid/U_Transmitter, U_FPGA/U_Grid/U_Transmitter, U_FPGA/U_Grid/U_Transmitter, U_FPGA/U_Grid/U_Transmitter, U_FPGA/U_Grid/U_Transmitter, U_FPGA/U_Grid/U_Transmitter, U_FPGA/U_Grid/U_Transmitter, U_FPGA/U_Grid/U_Transmitter, U_FPGA/U_Grid/U_Transmitter, U_FPGA/U_Grid/U_Transmitter, U_FPGA/U_Grid/U_Transmitter, U_FPGA/U_Grid/U_Transmitter, U_FPGA/U_Grid/U_Transmitter, U_FPGA/U_Grid/U_Transmitter, U_FPGA/U_Grid/U_Transmitter, U_FPGA/U_Grid/U_Transmitter, U_FPGA/U_Grid/U_Transmitter, U_FPGA/U_Grid/U_Transmitter, U_FPGA/U_Grid/U_Transmitter, U_FPGA/U_Grid/U_Transmitter, U_FPGA/U_Grid/U_Transmitter, U_FPGA/U_Grid/U_Transmitter, U_FPGA/U_Grid/U_Transmitter, U_FPGA/U_Grid/U_Transmitter, U_FPGA/U_Grid/U_Transmitter, U_FPGA/U_Grid/U_Transmitter, U_FPGA/U_Grid/U_Transmitter, U_FPGA/U_Grid/U_Transmitter, U_FPGA/U_Grid/U_Transmitter, U_FPGA/U_Grid/U_Transmitter, U_FPGA/U_Grid/U_Transmitter, U_FPGA/U_Grid/U_Transmitter, U_FPGA/U_Grid/U_Transmitter, U_FPGA/U_Grid/U_Transmitter, U_FPGA/U_Grid/U_Transmitter, U_FPGA/U_Grid/U_Transmitter, U_FPGA/U_Grid/U_Transmitter, U_FPGA/U_Grid/U_Transmitter, U_FPGA/U_Grid/U_Transmitter, U_FPGA/U_Grid/U_Transmitter, U_FPGA/U_Grid/U_Transmitter, U_FPGA/U_Grid/U_Transmitter. Parts and nets are listed once, with the designators drawn on the sheet.
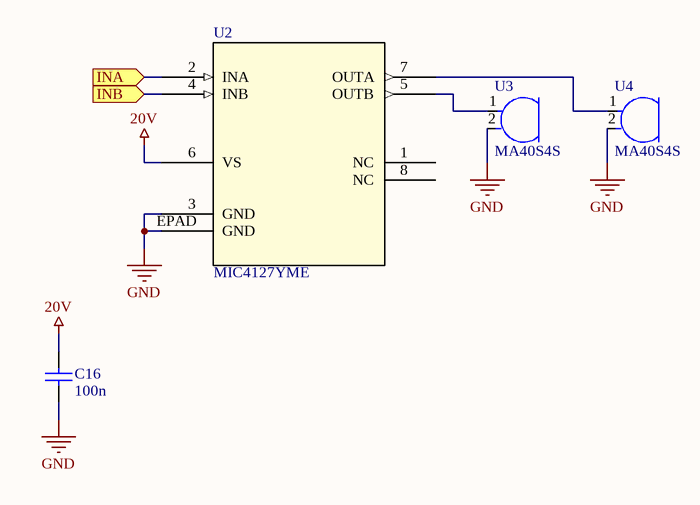
[diagram p3: Transmitter.SchDoc]

### Parts
C16  100n  [SAMS-C0603-2_M]
U2  MIC4127YME  [SOIC8_EQA_MCH]
U3  MA40S4S  [FP-MA40S4S-MFG]
U4  MA40S4S  [FP-MA40S4S-MFG]

### Ports
INA (in), INB (in)

### Nets
20V: C16.2 U2.6(VS)
GND: C16.1 U2.3(GND) U2.EPAD(GND) U3.2 U4.2
INA: U2.2(INA) ; port INA
INB: U2.4(INB) ; port INB
NetU2_5: U2.5(OUTB) U3.1
NetU2_7: U2.7(OUTA) U4.1

Not connected (* = marked no-connect by the designer): U2 1(NC) 8(NC)

### Channels
U_FPGA/U_Grid/U_Transmitter: designators end in _U_FPGA_U_Grid_U_Transmitter#1; ports INA=T1_U_Grid INB=T2_U_Grid
U_FPGA/U_Grid/U_Transmitter: designators end in _U_FPGA_U_Grid_U_Transmitter#2; ports INA=T3_U_Grid INB=T4_U_Grid
U_FPGA/U_Grid/U_Transmitter: designators end in _U_FPGA_U_Grid_U_Transmitter#3; ports INA=T5_U_Grid INB=T6_U_Grid
U_FPGA/U_Grid/U_Transmitter: designators end in _U_FPGA_U_Grid_U_Transmitter#4; ports INA=T7_U_Grid INB=T8_U_Grid
U_FPGA/U_Grid/U_Transmitter: designators end in _U_FPGA_U_Grid_U_Transmitter#5; ports INA=T9_U_Grid INB=T10_U_Grid
U_FPGA/U_Grid/U_Transmitter: designators end in _U_FPGA_U_Grid_U_Transmitter#6; ports INA=T11_U_Grid INB=T12_U_Grid
U_FPGA/U_Grid/U_Transmitter: designators end in _U_FPGA_U_Grid_U_Transmitter#7; ports INA=T13_U_Grid INB=T14_U_Grid
U_FPGA/U_Grid/U_Transmitter: designators end in _U_FPGA_U_Grid_U_Transmitter#8; ports INA=T15_U_Grid INB=T16_U_Grid
U_FPGA/U_Grid/U_Transmitter: designators end in _U_FPGA_U_Grid_U_Transmitter#9; ports INA=T17_U_Grid INB=T18_U_Grid
U_FPGA/U_Grid/U_Transmitter: designators end in _U_FPGA_U_Grid_U_Transmitter#10; ports INA=T19_U_Grid INB=T20_U_Grid
U_FPGA/U_Grid/U_Transmitter: designators end in _U_FPGA_U_Grid_U_Transmitter#11; ports INA=T21_U_Grid INB=T22_U_Grid
U_FPGA/U_Grid/U_Transmitter: designators end in _U_FPGA_U_Grid_U_Transmitter#12; ports INA=T23_U_Grid INB=T24_U_Grid
U_FPGA/U_Grid/U_Transmitter: designators end in _U_FPGA_U_Grid_U_Transmitter#13; ports INA=T25_U_Grid INB=T26_U_Grid
U_FPGA/U_Grid/U_Transmitter: designators end in _U_FPGA_U_Grid_U_Transmitter#14; ports INA=T27_U_Grid INB=T28_U_Grid
U_FPGA/U_Grid/U_Transmitter: designators end in _U_FPGA_U_Grid_U_Transmitter#15; ports INA=T29_U_Grid INB=T30_U_Grid
U_FPGA/U_Grid/U_Transmitter: designators end in _U_FPGA_U_Grid_U_Transmitter#16; ports INA=T31_U_Grid INB=T32_U_Grid
U_FPGA/U_Grid/U_Transmitter: designators end in _U_FPGA_U_Grid_U_Transmitter#17; ports INA=T33_U_Grid INB=T34_U_Grid
U_FPGA/U_Grid/U_Transmitter: designators end in _U_FPGA_U_Grid_U_Transmitter#18; ports INA=T35_U_Grid INB=T36_U_Grid
U_FPGA/U_Grid/U_Transmitter: designators end in _U_FPGA_U_Grid_U_Transmitter#19; ports INA=T37_U_Grid INB=T38_U_Grid
U_FPGA/U_Grid/U_Transmitter: designators end in _U_FPGA_U_Grid_U_Transmitter#20; ports INA=T39_U_Grid INB=T40_U_Grid
U_FPGA/U_Grid/U_Transmitter: designators end in _U_FPGA_U_Grid_U_Transmitter#21; ports INA=T41_U_Grid INB=T42_U_Grid
U_FPGA/U_Grid/U_Transmitter: designators end in _U_FPGA_U_Grid_U_Transmitter#22; ports INA=T43_U_Grid INB=T44_U_Grid
U_FPGA/U_Grid/U_Transmitter: designators end in _U_FPGA_U_Grid_U_Transmitter#23; ports INA=T45_U_Grid INB=T46_U_Grid
U_FPGA/U_Grid/U_Transmitter: designators end in _U_FPGA_U_Grid_U_Transmitter#24; ports INA=T47_U_Grid INB=T48_U_Grid
U_FPGA/U_Grid/U_Transmitter: designators end in _U_FPGA_U_Grid_U_Transmitter#25; ports INA=T49_U_Grid INB=T50_U_Grid
U_FPGA/U_Grid/U_Transmitter: designators end in _U_FPGA_U_Grid_U_Transmitter#26; ports INA=T1_U_Grid INB=T2_U_Grid
U_FPGA/U_Grid/U_Transmitter: designators end in _U_FPGA_U_Grid_U_Transmitter#27; ports INA=T3_U_Grid INB=T4_U_Grid
U_FPGA/U_Grid/U_Transmitter: designators end in _U_FPGA_U_Grid_U_Transmitter#28; ports INA=T5_U_Grid INB=T6_U_Grid
U_FPGA/U_Grid/U_Transmitter: designators end in _U_FPGA_U_Grid_U_Transmitter#29; ports INA=T7_U_Grid INB=T8_U_Grid
U_FPGA/U_Grid/U_Transmitter: designators end in _U_FPGA_U_Grid_U_Transmitter#30; ports INA=T9_U_Grid INB=T10_U_Grid
U_FPGA/U_Grid/U_Transmitter: designators end in _U_FPGA_U_Grid_U_Transmitter#31; ports INA=T11_U_Grid INB=T12_U_Grid
U_FPGA/U_Grid/U_Transmitter: designators end in _U_FPGA_U_Grid_U_Transmitter#32; ports INA=T13_U_Grid INB=T14_U_Grid
U_FPGA/U_Grid/U_Transmitter: designators end in _U_FPGA_U_Grid_U_Transmitter#33; ports INA=T15_U_Grid INB=T16_U_Grid
U_FPGA/U_Grid/U_Transmitter: designators end in _U_FPGA_U_Grid_U_Transmitter#34; ports INA=T17_U_Grid INB=T18_U_Grid
U_FPGA/U_Grid/U_Transmitter: designators end in _U_FPGA_U_Grid_U_Transmitter#35; ports INA=T19_U_Grid INB=T20_U_Grid
U_FPGA/U_Grid/U_Transmitter: designators end in _U_FPGA_U_Grid_U_Transmitter#36; ports INA=T21_U_Grid INB=T22_U_Grid
U_FPGA/U_Grid/U_Transmitter: designators end in _U_FPGA_U_Grid_U_Transmitter#37; ports INA=T23_U_Grid INB=T24_U_Grid
U_FPGA/U_Grid/U_Transmitter: designators end in _U_FPGA_U_Grid_U_Transmitter#38; ports INA=T25_U_Grid INB=T26_U_Grid
U_FPGA/U_Grid/U_Transmitter: designators end in _U_FPGA_U_Grid_U_Transmitter#39; ports INA=T27_U_Grid INB=T28_U_Grid
U_FPGA/U_Grid/U_Transmitter: designators end in _U_FPGA_U_Grid_U_Transmitter#40; ports INA=T29_U_Grid INB=T30_U_Grid
U_FPGA/U_Grid/U_Transmitter: designators end in _U_FPGA_U_Grid_U_Transmitter#41; ports INA=T31_U_Grid INB=T32_U_Grid
U_FPGA/U_Grid/U_Transmitter: designators end in _U_FPGA_U_Grid_U_Transmitter#42; ports INA=T33_U_Grid INB=T34_U_Grid
U_FPGA/U_Grid/U_Transmitter: designators end in _U_FPGA_U_Grid_U_Transmitter#43; ports INA=T35_U_Grid INB=T36_U_Grid
U_FPGA/U_Grid/U_Transmitter: designators end in _U_FPGA_U_Grid_U_Transmitter#44; ports INA=T37_U_Grid INB=T38_U_Grid
U_FPGA/U_Grid/U_Transmitter: designators end in _U_FPGA_U_Grid_U_Transmitter#45; ports INA=T39_U_Grid INB=T40_U_Grid
U_FPGA/U_Grid/U_Transmitter: designators end in _U_FPGA_U_Grid_U_Transmitter#46; ports INA=T41_U_Grid INB=T42_U_Grid
U_FPGA/U_Grid/U_Transmitter: designators end in _U_FPGA_U_Grid_U_Transmitter#47; ports INA=T43_U_Grid INB=T44_U_Grid
U_FPGA/U_Grid/U_Transmitter: designators end in _U_FPGA_U_Grid_U_Transmitter#48; ports INA=T45_U_Grid INB=T46_U_Grid
U_FPGA/U_Grid/U_Transmitter: designators end in _U_FPGA_U_Grid_U_Transmitter#49; ports INA=T47_U_Grid INB=T48_U_Grid
U_FPGA/U_Grid/U_Transmitter: designators end in _U_FPGA_U_Grid_U_Transmitter#50; ports INA=T49_U_Grid INB=T50_U_Grid

### Library data of the parts
C16 = CMP-2000-05332-1: as C18 on sheet Main; Case Size/Dimension: 0603; Datasheet URL: https://datasheet.ciiva.com/29198/456651-da-01-en-vs-kondensator-0605-29198839.pdf; Manufacturer URL: http://www.samsungsem.com/global/index.jsp; Datasheet Version: Nov-10
U2 = MIC4127YME: No Description Available; Mfr_Name: Microchip; Copyright: Copyright (C) 2022 Ultra Librarian. All rights reserved.; Manufacturer_Part_Number: MIC4127YME; RefDes: RefDes; Type: DEV
U3 U4 = CMP-06153-000002-1: ULTRASONIC SENSOR TRANS 40KHZ; Voltage Rating: 20V; Capacitance: 2.55nF; Outside Diameter: 9.9mm; Max Operating Temperature: 85°C; Radiation Hardening: No; Frequency: 40kHz; Self Resonant Frequency: 40kHz; Mount: PCB; Voltage Rating (DC): 20V; Number of Pins: 2; Package Quantity: 100; Operating Supply Voltage: 20V; Lead Free: Lead Free; Termination: PCB; Length: 7.1mm; Min Operating Temperature: -40°C; Height: 7.1mm; REACH SVHC: No SVHC; Switching Frequency: 40kHz; Diameter: 10mm

## Nets that join several sheets
1V2: Main (6 pins), U_FPGA (19 pins), U_FPGA (19 pins)
3V3: Main (18 pins), U_FPGA (31 pins), U_FPGA (31 pins)
20V: Main (7 pins), U_FPGA/U_Grid/U_Transmitter (C16_U_FPGA_U_Grid_U_Transmitter#1.2 U2_U_FPGA_U_Grid_U_Transmitter#1.6), U_FPGA/U_Grid/U_Transmitter (C16_U_FPGA_U_Grid_U_Transmitter#2.2 U2_U_FPGA_U_Grid_U_Transmitter#2.6), U_FPGA/U_Grid/U_Transmitter (C16_U_FPGA_U_Grid_U_Transmitter#3.2 U2_U_FPGA_U_Grid_U_Transmitter#3.6), U_FPGA/U_Grid/U_Transmitter (C16_U_FPGA_U_Grid_U_Transmitter#4.2 U2_U_FPGA_U_Grid_U_Transmitter#4.6), U_FPGA/U_Grid/U_Transmitter (C16_U_FPGA_U_Grid_U_Transmitter#5.2 U2_U_FPGA_U_Grid_U_Transmitter#5.6), U_FPGA/U_Grid/U_Transmitter (C16_U_FPGA_U_Grid_U_Transmitter#6.2 U2_U_FPGA_U_Grid_U_Transmitter#6.6), U_FPGA/U_Grid/U_Transmitter (C16_U_FPGA_U_Grid_U_Transmitter#7.2 U2_U_FPGA_U_Grid_U_Transmitter#7.6), U_FPGA/U_Grid/U_Transmitter (C16_U_FPGA_U_Grid_U_Transmitter#8.2 U2_U_FPGA_U_Grid_U_Transmitter#8.6), U_FPGA/U_Grid/U_Transmitter (C16_U_FPGA_U_Grid_U_Transmitter#9.2 U2_U_FPGA_U_Grid_U_Transmitter#9.6), U_FPGA/U_Grid/U_Transmitter (C16_U_FPGA_U_Grid_U_Transmitter#10.2 U2_U_FPGA_U_Grid_U_Transmitter#10.6), U_FPGA/U_Grid/U_Transmitter (C16_U_FPGA_U_Grid_U_Transmitter#11.2 U2_U_FPGA_U_Grid_U_Transmitter#11.6), U_FPGA/U_Grid/U_Transmitter (C16_U_FPGA_U_Grid_U_Transmitter#12.2 U2_U_FPGA_U_Grid_U_Transmitter#12.6), U_FPGA/U_Grid/U_Transmitter (C16_U_FPGA_U_Grid_U_Transmitter#13.2 U2_U_FPGA_U_Grid_U_Transmitter#13.6), U_FPGA/U_Grid/U_Transmitter (C16_U_FPGA_U_Grid_U_Transmitter#14.2 U2_U_FPGA_U_Grid_U_Transmitter#14.6), U_FPGA/U_Grid/U_Transmitter (C16_U_FPGA_U_Grid_U_Transmitter#15.2 U2_U_FPGA_U_Grid_U_Transmitter#15.6), U_FPGA/U_Grid/U_Transmitter (C16_U_FPGA_U_Grid_U_Transmitter#16.2 U2_U_FPGA_U_Grid_U_Transmitter#16.6), U_FPGA/U_Grid/U_Transmitter (C16_U_FPGA_U_Grid_U_Transmitter#17.2 U2_U_FPGA_U_Grid_U_Transmitter#17.6), U_FPGA/U_Grid/U_Transmitter (C16_U_FPGA_U_Grid_U_Transmitter#18.2 U2_U_FPGA_U_Grid_U_Transmitter#18.6), U_FPGA/U_Grid/U_Transmitter (C16_U_FPGA_U_Grid_U_Transmitter#19.2 U2_U_FPGA_U_Grid_U_Transmitter#19.6), U_FPGA/U_Grid/U_Transmitter (C16_U_FPGA_U_Grid_U_Transmitter#20.2 U2_U_FPGA_U_Grid_U_Transmitter#20.6), U_FPGA/U_Grid/U_Transmitter (C16_U_FPGA_U_Grid_U_Transmitter#21.2 U2_U_FPGA_U_Grid_U_Transmitter#21.6), U_FPGA/U_Grid/U_Transmitter (C16_U_FPGA_U_Grid_U_Transmitter#22.2 U2_U_FPGA_U_Grid_U_Transmitter#22.6), U_FPGA/U_Grid/U_Transmitter (C16_U_FPGA_U_Grid_U_Transmitter#23.2 U2_U_FPGA_U_Grid_U_Transmitter#23.6), U_FPGA/U_Grid/U_Transmitter (C16_U_FPGA_U_Grid_U_Transmitter#24.2 U2_U_FPGA_U_Grid_U_Transmitter#24.6), U_FPGA/U_Grid/U_Transmitter (C16_U_FPGA_U_Grid_U_Transmitter#25.2 U2_U_FPGA_U_Grid_U_Transmitter#25.6), U_FPGA/U_Grid/U_Transmitter (C16_U_FPGA_U_Grid_U_Transmitter#26.2 U2_U_FPGA_U_Grid_U_Transmitter#26.6), U_FPGA/U_Grid/U_Transmitter (C16_U_FPGA_U_Grid_U_Transmitter#27.2 U2_U_FPGA_U_Grid_U_Transmitter#27.6), U_FPGA/U_Grid/U_Transmitter (C16_U_FPGA_U_Grid_U_Transmitter#28.2 U2_U_FPGA_U_Grid_U_Transmitter#28.6), U_FPGA/U_Grid/U_Transmitter (C16_U_FPGA_U_Grid_U_Transmitter#29.2 U2_U_FPGA_U_Grid_U_Transmitter#29.6), U_FPGA/U_Grid/U_Transmitter (C16_U_FPGA_U_Grid_U_Transmitter#30.2 U2_U_FPGA_U_Grid_U_Transmitter#30.6), U_FPGA/U_Grid/U_Transmitter (C16_U_FPGA_U_Grid_U_Transmitter#31.2 U2_U_FPGA_U_Grid_U_Transmitter#31.6), U_FPGA/U_Grid/U_Transmitter (C16_U_FPGA_U_Grid_U_Transmitter#32.2 U2_U_FPGA_U_Grid_U_Transmitter#32.6), U_FPGA/U_Grid/U_Transmitter (C16_U_FPGA_U_Grid_U_Transmitter#33.2 U2_U_FPGA_U_Grid_U_Transmitter#33.6), U_FPGA/U_Grid/U_Transmitter (C16_U_FPGA_U_Grid_U_Transmitter#34.2 U2_U_FPGA_U_Grid_U_Transmitter#34.6), U_FPGA/U_Grid/U_Transmitter (C16_U_FPGA_U_Grid_U_Transmitter#35.2 U2_U_FPGA_U_Grid_U_Transmitter#35.6), U_FPGA/U_Grid/U_Transmitter (C16_U_FPGA_U_Grid_U_Transmitter#36.2 U2_U_FPGA_U_Grid_U_Transmitter#36.6), U_FPGA/U_Grid/U_Transmitter (C16_U_FPGA_U_Grid_U_Transmitter#37.2 U2_U_FPGA_U_Grid_U_Transmitter#37.6), U_FPGA/U_Grid/U_Transmitter (C16_U_FPGA_U_Grid_U_Transmitter#38.2 U2_U_FPGA_U_Grid_U_Transmitter#38.6), U_FPGA/U_Grid/U_Transmitter (C16_U_FPGA_U_Grid_U_Transmitter#39.2 U2_U_FPGA_U_Grid_U_Transmitter#39.6), U_FPGA/U_Grid/U_Transmitter (C16_U_FPGA_U_Grid_U_Transmitter#40.2 U2_U_FPGA_U_Grid_U_Transmitter#40.6), U_FPGA/U_Grid/U_Transmitter (C16_U_FPGA_U_Grid_U_Transmitter#41.2 U2_U_FPGA_U_Grid_U_Transmitter#41.6), U_FPGA/U_Grid/U_Transmitter (C16_U_FPGA_U_Grid_U_Transmitter#42.2 U2_U_FPGA_U_Grid_U_Transmitter#42.6), U_FPGA/U_Grid/U_Transmitter (C16_U_FPGA_U_Grid_U_Transmitter#43.2 U2_U_FPGA_U_Grid_U_Transmitter#43.6), U_FPGA/U_Grid/U_Transmitter (C16_U_FPGA_U_Grid_U_Transmitter#44.2 U2_U_FPGA_U_Grid_U_Transmitter#44.6), U_FPGA/U_Grid/U_Transmitter (C16_U_FPGA_U_Grid_U_Transmitter#45.2 U2_U_FPGA_U_Grid_U_Transmitter#45.6), U_FPGA/U_Grid/U_Transmitter (C16_U_FPGA_U_Grid_U_Transmitter#46.2 U2_U_FPGA_U_Grid_U_Transmitter#46.6), U_FPGA/U_Grid/U_Transmitter (C16_U_FPGA_U_Grid_U_Transmitter#47.2 U2_U_FPGA_U_Grid_U_Transmitter#47.6), U_FPGA/U_Grid/U_Transmitter (C16_U_FPGA_U_Grid_U_Transmitter#48.2 U2_U_FPGA_U_Grid_U_Transmitter#48.6), U_FPGA/U_Grid/U_Transmitter (C16_U_FPGA_U_Grid_U_Transmitter#49.2 U2_U_FPGA_U_Grid_U_Transmitter#49.6), U_FPGA/U_Grid/U_Transmitter (C16_U_FPGA_U_Grid_U_Transmitter#50.2 U2_U_FPGA_U_Grid_U_Transmitter#50.6)
GND: Main (52 pins), U_FPGA (34 pins), U_FPGA/U_Grid/U_Transmitter (5 pins), U_FPGA/U_Grid/U_Transmitter (5 pins), U_FPGA/U_Grid/U_Transmitter (5 pins), U_FPGA/U_Grid/U_Transmitter (5 pins), U_FPGA/U_Grid/U_Transmitter (5 pins), U_FPGA/U_Grid/U_Transmitter (5 pins), U_FPGA/U_Grid/U_Transmitter (5 pins), U_FPGA/U_Grid/U_Transmitter (5 pins), U_FPGA/U_Grid/U_Transmitter (5 pins), U_FPGA/U_Grid/U_Transmitter (5 pins), U_FPGA/U_Grid/U_Transmitter (5 pins), U_FPGA/U_Grid/U_Transmitter (5 pins), U_FPGA/U_Grid/U_Transmitter (5 pins), U_FPGA/U_Grid/U_Transmitter (5 pins), U_FPGA/U_Grid/U_Transmitter (5 pins), U_FPGA/U_Grid/U_Transmitter (5 pins), U_FPGA/U_Grid/U_Transmitter (5 pins), U_FPGA/U_Grid/U_Transmitter (5 pins), U_FPGA/U_Grid/U_Transmitter (5 pins), U_FPGA/U_Grid/U_Transmitter (5 pins), U_FPGA/U_Grid/U_Transmitter (5 pins), U_FPGA/U_Grid/U_Transmitter (5 pins), U_FPGA/U_Grid/U_Transmitter (5 pins), U_FPGA/U_Grid/U_Transmitter (5 pins), U_FPGA/U_Grid/U_Transmitter (5 pins), U_FPGA (34 pins), U_FPGA/U_Grid/U_Transmitter (5 pins), U_FPGA/U_Grid/U_Transmitter (5 pins), U_FPGA/U_Grid/U_Transmitter (5 pins), U_FPGA/U_Grid/U_Transmitter (5 pins), U_FPGA/U_Grid/U_Transmitter (5 pins), U_FPGA/U_Grid/U_Transmitter (5 pins), U_FPGA/U_Grid/U_Transmitter (5 pins), U_FPGA/U_Grid/U_Transmitter (5 pins), U_FPGA/U_Grid/U_Transmitter (5 pins), U_FPGA/U_Grid/U_Transmitter (5 pins), U_FPGA/U_Grid/U_Transmitter (5 pins), U_FPGA/U_Grid/U_Transmitter (5 pins), U_FPGA/U_Grid/U_Transmitter (5 pins), U_FPGA/U_Grid/U_Transmitter (5 pins), U_FPGA/U_Grid/U_Transmitter (5 pins), U_FPGA/U_Grid/U_Transmitter (5 pins), U_FPGA/U_Grid/U_Transmitter (5 pins), U_FPGA/U_Grid/U_Transmitter (5 pins), U_FPGA/U_Grid/U_Transmitter (5 pins), U_FPGA/U_Grid/U_Transmitter (5 pins), U_FPGA/U_Grid/U_Transmitter (5 pins), U_FPGA/U_Grid/U_Transmitter (5 pins), U_FPGA/U_Grid/U_Transmitter (5 pins), U_FPGA/U_Grid/U_Transmitter (5 pins), U_FPGA/U_Grid/U_Transmitter (5 pins)
CCK: Main (R17.1 U6.6), U_FPGA (U1_U_FPGA#1.30), U_FPGA (U1_U_FPGA#2.30)
CCK_DATA: Main (P?.1 U5.8), U_FPGA (U1_U_FPGA#1.14), U_FPGA (U1_U_FPGA#2.14)
CDI0: Main (R14.1 U6.5), U_FPGA (U1_U_FPGA#1.29)
CDI1: Main (R15.1 U6.2), U_FPGA (U1_U_FPGA#1.28), U_FPGA (U1_U_FPGA#2.29)
CDONE: Main (R13.2 R28.1), U_FPGA (U1_U_FPGA#1.34), U_FPGA (U1_U_FPGA#2.34)
CRESET: Main (P?.2 R29.1 U7.9), U_FPGA (U1_U_FPGA#1.35), U_FPGA (U1_U_FPGA#2.35)
CS0: Main (R41.2 U5.17), U_FPGA (U1_U_FPGA#1.17)
CS1: Main (R42.2 U5.13), U_FPGA (U1_U_FPGA#2.17)
EXT_SYNC_IN: Main (P?.13 R40.1), U_FPGA (U1_U_FPGA#1.19)
EXT_SYNC_OUT: Main (P?.11 R39.2 R40.2), U_FPGA (U1_U_FPGA#2.19)
MISO_DATA: Main (P?.3 U5.9), U_FPGA (U1_U_FPGA#1.15), U_FPGA (U1_U_FPGA#2.15)
MOSI_DATA: Main (P?.5 U5.10), U_FPGA (U1_U_FPGA#1.16), U_FPGA (U1_U_FPGA#2.16)
NetR1_U_FPGA#1_2: Main (R38.1), U_FPGA (R1_U_FPGA#1.2 U1_U_FPGA#1.20)
NetR12_1: Main (R12.1), U_FPGA (U1_U_FPGA#1.32)
NetR37_1: Main (R37.1), U_FPGA (U1_U_FPGA#2.31)
NetR39_1: Main (R39.1), U_FPGA (U1_U_FPGA#1.18)
NetU1_U_FPGA#1_33: U_FPGA (U1_U_FPGA#1.33), U_FPGA (U1_U_FPGA#2.32)
SS: Main (R16.1 U6.1), U_FPGA (U1_U_FPGA#1.31)